# Altium project PCB_Project_1.PrjPcb
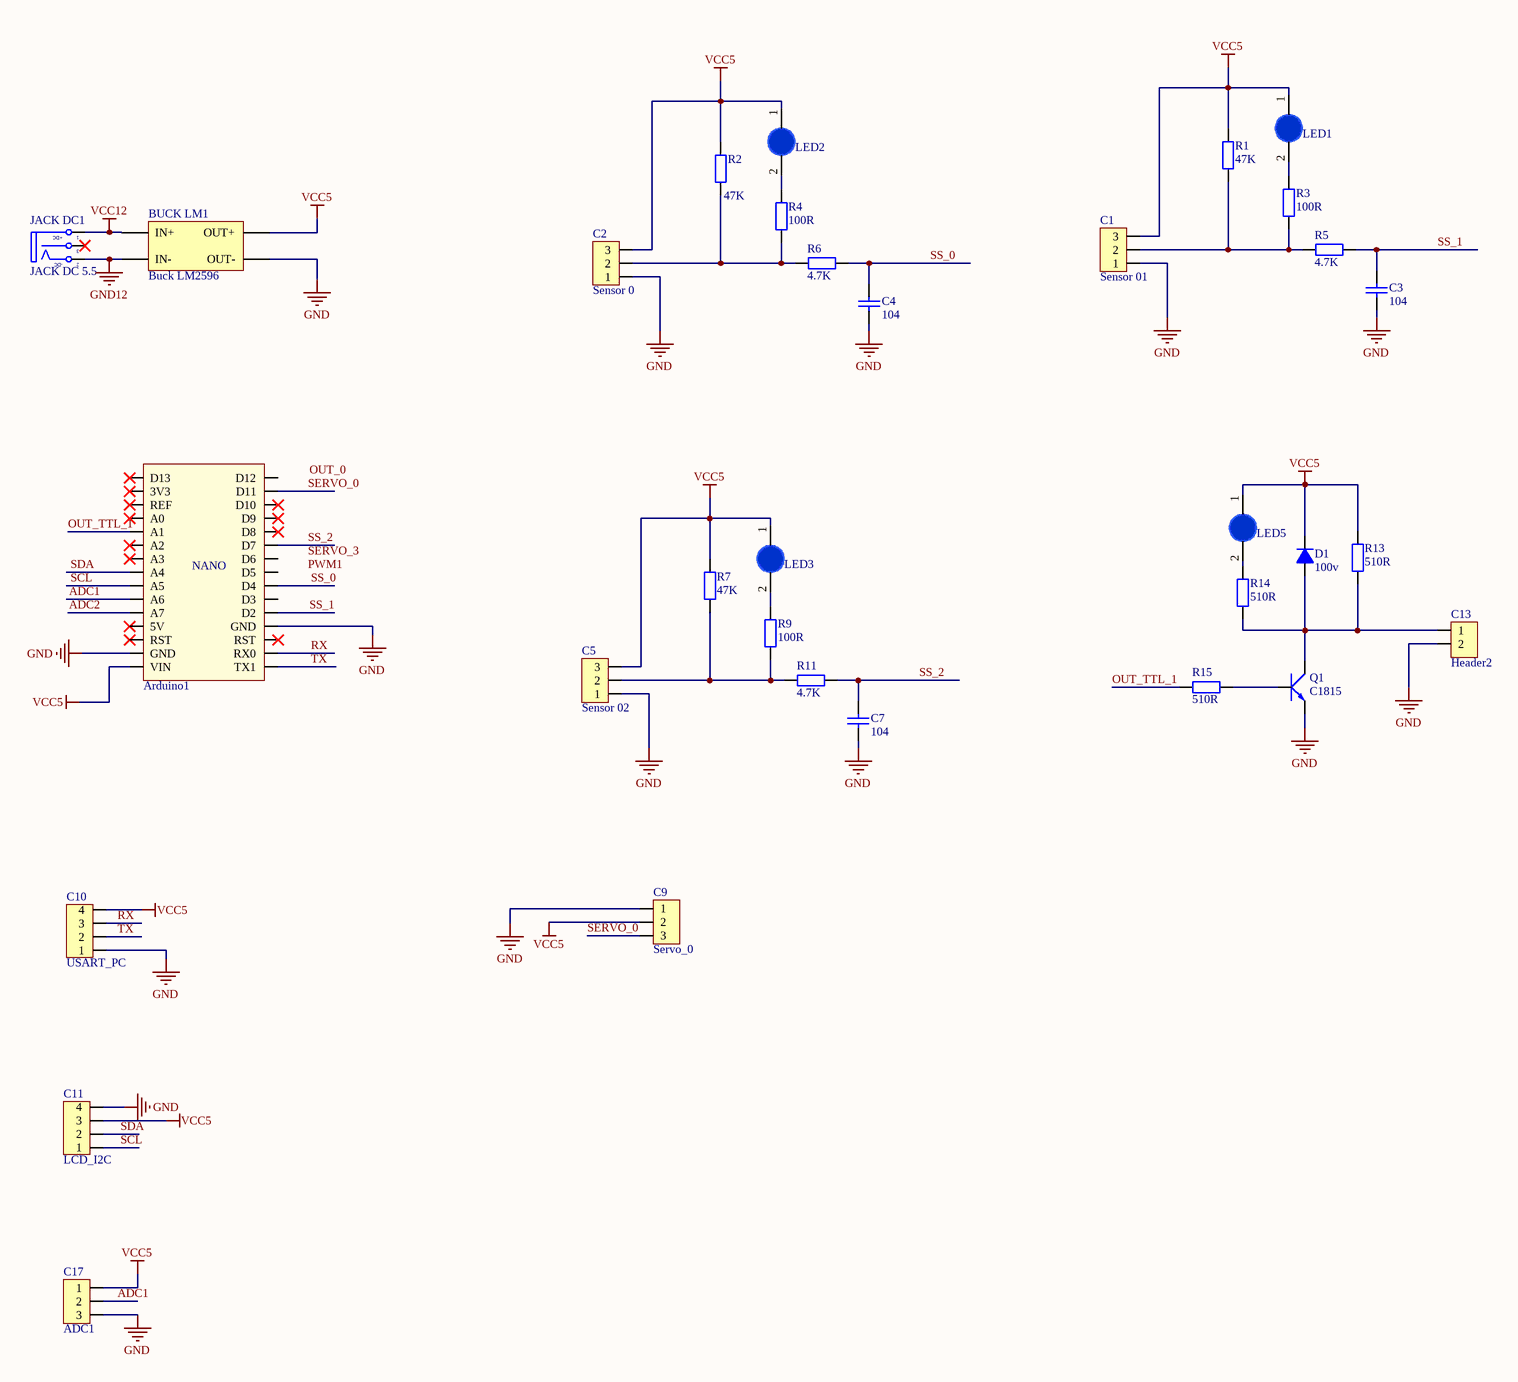
[diagram p0: Sheet1.SchDoc]
1 sheet, 32 parts. Net scope: global (net labels, ports and power ports of the same name join across sheets).
Board file: PCB1.PcbDoc

## Sheet Sheet1.SchDoc
size A2; SheetNumber: 1; SheetTotal: 1

### Parts
Arduino1  Arduino Nano  [Arduino Nano]  (value not drawn)
BUCK_LM1  Buck LM2596  [BUCK LM2596]
C1  Sensor 01  [Header3]
C2  Sensor 0  [Header3]
C3  104  [tu gom]
C4  104  [tu gom]
C5  Sensor 02  [Header3]
C7  104  [tu gom]
C9  Servo_0  [Header3]
C10  USART_PC  [Header4]
C11  LCD_I2C  [Header4]
C13  Header2  [Header2]
C17  ADC1  [Header3]
D1  100v  [DIODE 0.5A]
JACK_DC1  JACK DC 5.5  [JACK DC 5.5]
LED1  LED 3mm  [LED-3MM-BLUE]  (value not drawn)
LED2  LED 3mm  [LED-3MM-BLUE]  (value not drawn)
LED3  LED 3mm  [LED-3MM-BLUE]  (value not drawn)
LED5  LED 3mm  [LED-3MM-BLUE]  (value not drawn)
Q1  C1815  [C1815_cam]
R1  47K  [R1/4W]
R2  47K  [R1/4W]
R3  100R  [R1/4W]
R4  100R  [R1/4W]
R5  4.7K  [R1/4W]
R6  4.7K  [R1/4W]
R7  47K  [R1/4W]
R9  100R  [R1/4W]
R11  4.7K  [R1/4W]
R13  510R  [R1/4W]
R14  510R  [R1/4W]
R15  510R  [R1/4W]

### Nets
GND: Arduino1.GND BUCK_LM1.3(OUT-) C1.1 C2.1 C3.2 C4.2 C5.1 C7.2 C9.1 C10.1 C11.4 C13.2 C17.3 Q1.1(E)
GND12: BUCK_LM1.2(IN-) JACK_DC1.2(TN)
VCC5: Arduino1.VIN BUCK_LM1.4(OUT+) C1.3 C2.3 C5.3 C9.2 C10.4 C11.3 C17.1 D1.2(K) LED1.1(A) LED2.1(A) LED3.1(A) LED5.1(A) R1.2 R2.2 R7.2 R13.1
VCC12: BUCK_LM1.1(IN+) JACK_DC1.1(T)
ADC1: Arduino1.A6 C17.2
ADC2: Arduino1.A7
OUT_TTL_1: Arduino1.A1 R15.1
RX: Arduino1.RX0 C10.3
SCL: Arduino1.A5 C11.1
SDA: Arduino1.A4 C11.2
SERVO_0: Arduino1.D11 C9.3
SS_0: Arduino1.D4 C4.1 R6.1
SS_1: Arduino1.D2 C3.1 R5.1
SS_2: Arduino1.D7 C7.1 R11.1
TX: Arduino1.TX1 C10.2
NetC1_2: C1.2 R1.1 R3.1 R5.2
NetC2_2: C2.2 R2.1 R4.1 R6.2
NetC5_2: C5.2 R7.1 R9.1 R11.2
NetC13_1: C13.1 D1.1(A) Q1.2(C) R13.2 R14.2
NetLED1_2: LED1.2(K) R3.2
NetLED2_2: LED2.2(K) R4.2
NetLED3_2: LED3.2(K) R9.2
NetLED5_2: LED5.2(K) R14.1
NetQ1_3: Q1.3(B) R15.2

Not connected (* = marked no-connect by the designer): Arduino1 3V3* 5V* A0* A2* A3* D3 D5 D6 D8* D9* D10* D12 D13* REF* RST*; JACK_DC1 3(S)*

### Notes on the sheet
- Labels drawn without touching a wire or pin: OUT_0, PWM1, SERVO_3
- (in symbol Arduino Nano) NANO
- (in symbol JACK DC 5.5) +DC; -DC

### Library data of the parts
Arduino1 = Arduino Nano: Value: Cau 1A
C1 C2 C5 C9 C17 = Header3: Header IDC, 3 x 1 Pin Vertical 2.54mm Pitch (Non-Boxed, Male); Manufacturer: W¨¹rth Elektronik eiSos GmbH; partNo: 613002143121; ComponentLink1 Description: Manufacturer; ComponentLink2 Description: Datasheet; NoPins: 02; Created Date: 29 March 2013; ComponentLink1URL: http://www.we-online.com; ComponentLink2URL: http://katalog.we-online.de/em/datasheet/6130xx143121.pdf; Created by: Karrer Zheng
C3 C4 C7 = Tu gom 104 50V: Cắm; So_Chan: 2; Ten_Linh_Kien: Tụ gốm 104 100nF 50V; Don_Vi: Con; Ma_Hang: MH004761; Chung_Loai: Cắm; Kieu_Chan: *
C10 C11 = Header4: Header IDC, 4 x 1 Pin Vertical 2.54mm Pitch (Non-Boxed, Male); Manufacturer: W¨¹rth Elektronik eiSos GmbH; partNo: 613002143121; ComponentLink1 Description: Manufacturer; ComponentLink2 Description: Datasheet; NoPins: 02; Created Date: 29 March 2013; ComponentLink1URL: http://www.we-online.com; ComponentLink2URL: http://katalog.we-online.de/em/datasheet/6130xx143121.pdf; Created by: Karrer Zheng
C13 = Header2: Header IDC, 2 x 1 Pin Vertical 2.54mm Pitch (Non-Boxed, Male); Manufacturer: W¨¹rth Elektronik eiSos GmbH; partNo: 613002143121; ComponentLink1 Description: Manufacturer; ComponentLink2 Description: Datasheet; NoPins: 02; Created Date: 29 March 2013; ComponentLink1URL: http://www.we-online.com; ComponentLink2URL: http://katalog.we-online.de/em/datasheet/6130xx143121.pdf; Created by: Karrer Zheng
D1 = Diode 1N4148: Cắm; Ten_Linh_Kien: Diode 1N4148 DO35 450mA 100V ( 1N4148 DIP); Don_Vi: Con; Ma_Hang: MH001065; Ghi Chu: *; Kieu_Chan: *; Chung_Loai: Cắm
JACK_DC1 = JACK DC 5.5: Value: Jac DC
LED1-LED3 LED5 = LED 3mm Xanh Duong: Cắm; Don_Vi: Con; Ma_Hang: MH009003; Ten_Linh_Kien: LED 3MM Xanh Dương SS (1000c); Ghi_Chu: *; Kieu_Chan: *; Chung_Loai: Cắm
Q1 = C1815: NPN 600mW, ECB; Value: C1815
R1-R7 R9 R11 R13-R15 = R1/4W: Resistor 1/4W; Value: R1/4W - 1K